# Altium schematic sheet 11_PWR_SYS.SchDoc
size 420 x 297 mm; DocumentNumber: LM2596S-5.0; SheetNumber: 11; SheetTotal: 11
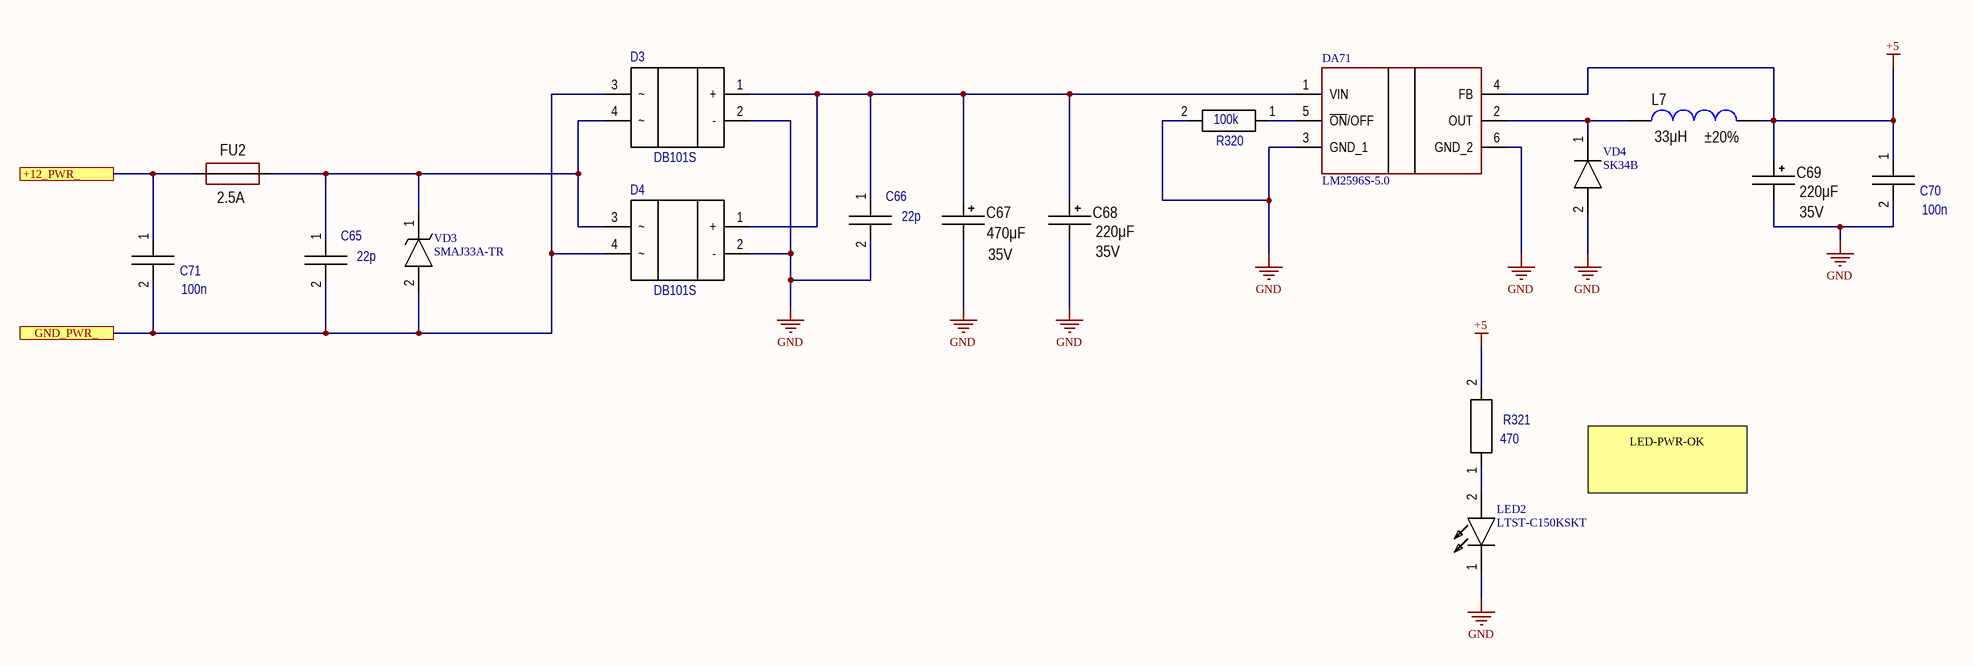
[diagram p0: 11_PWR_SYS.SchDoc]

## Parts
C65  value 22p  [C0603]  (hidden comment: C0603)
C66  value 22p  [C0603]  (hidden comment: C0603)
C67  value 470μF  Voltage: 35V  [CAP: D10C5H16]
C68  value 220μF  Voltage: 35V  [CAP: D8C3.5H12]
C69  value 220μF  Voltage: 35V  [CAP: D8C3.5H12]
C70  value 100n  [C0603]  (hidden comment: C0603)
C71  value 100n  [C0603]  (hidden comment: C0603)
D3  DB101S  [DB-1S]
D4  DB101S  [DB-1S]
DA71  LM2596S-5.0  [KTT0005B]
FU2  MaxCurrent: 2.5A  [FUSE: 1206]
L7  value 33μH  Tolerance: ±20%  [INDPM102100X400N]
LED2  LTST-C150KSKT  [LEDC3216X110N]
R320  value 100k  [RESC1608N]  (hidden comment: R0603)
R321  value 470  [RESC1608N]  (hidden comment: R0603)
VD3  SMAJ33A-TR  [SM4T82AY]
VD4  SK34B  [DIOM5236X261N]

## Ports
+12_PWR_, GND_PWR_

## Nets
+5: C69.1 C70.1 DA71.4(FB) L7.1 R321.2
GND: C66.2 C67.2 C68.2 C69.2 C70.2 D3.2(-) D4.2(-) DA71.3(GND_1) DA71.6(GND_2) LED2.1(K) R320.2 VD4.2(A)
+12_PWR_: C71.1 FU2.1 ; port +12_PWR_
GND_PWR_: C65.2 C71.2 D3.3 D4.4 VD3.2(A) ; port GND_PWR_
NetC65_1: C65.1 D3.4 D4.3 FU2.2 VD3.1(K)
NetC66_1: C66.1 C67.1 C68.1 D3.1(+) D4.1(+) DA71.1(VIN)
NetDA71_2: DA71.2(OUT) L7.2 VD4.1(K)
NetDA71_5: DA71.5(~{ON}/OFF) R320.1
NetLED2_2: LED2.2(A) R321.1

## Notes on the sheet
- LED-PWR-OK
- Подп. и дата
- Инв. № дубл.
- Взам. инв. №
- Инв. № подл.
- Изм.
- Лист
- № докум.
- Подп.
- Дата
- 2.106-A3
- Копировал
- Формат А3

## Library data of the parts
C65 C66 = GRM1885C1H220JA01D: Manufacturer: Murata Manufacturing; Код: 80; ID: Конденсатор; Power/Voltage: 50V; Tolerance: ±5%; TKE: c0g; iii: Конденсатор GRM1885C1H220JA01D 22p 50V ±5% C0603 c0g Murata Manufacturing; Comments: C0603; Part Number: GRM1885C1H220JA01D; Package: C0603; TemperatureMin: -55; TemperatureMax: 125
C67 = Capacitors_Aluminium: ECAP (К50-35), 470мкФ, 35В, 105°C, 20%, 10x17мм P:5мм; Manufacturer: JB Capacitors; PartNumber: JRB1V471M05001000170000B; ValueManufacturerPartNumber: Aluminium capacitor, 470μF, 35V, ±20%, 54mOhm, D10H17P5, -55...+105°C; TypeCapacitor: Aluminium capacitor; Impedance: 54mOhm; Package: D10H17P5; Temperature: -55...+105°C; Tolerance: ±20%
C68 C69 = Capacitors_Aluminium: ECAP (К50-35), 220мкФ, 35В, 105°C, 20%, 8x12мм P:3.5мм, Конденсатор электролитический алюминиевый; Manufacturer: JB Capacitors; PartNumber: JRB1V221M03500800120000B; ValueManufacturerPartNumber: Aluminium capacitor, 220μF, 35V, ±20%, 54mOhm, D8C3.5H12, -55...+105°C; TypeCapacitor: Aluminium capacitor; Impedance: 54mOhm; Package: D8C3.5H12; Temperature: -55...+105°C; Tolerance: ±20%
C70 C71 = GRM188R71C104KA01D: Manufacturer: Murata Manufacturing; Код: 22; ID: Конденсатор; Power/Voltage: 16V; Tolerance: ±10%; TKE: X7R; iii: Конденсатор GRM188R71C104KA01D 100n 16V ±10% C0603 X7R  Murata Manufacturing; Comments: C0603; Part Number: GRM188R71C104KA01D; Height: 0.9; Package: C0603; TemperatureMin: -55; TemperatureMax: 125
D3 D4 = DB101S: SINGLE-PHASE SURFACE MOUNT BRIDGE RECTIFIER; Manufacturer: DC COMPONENTS; Код: 5; ID: Диодный мост; Value: 1A; Power/Voltage: 50V; iii: Диодный мост DB101S 1A 50V    DC COMPONENTS; Com: DB101S; Part Number: DB101S; ComponentLink1Description: Datasheet; ComponentLink1URL: \\server_altium\ServerShare\Schematic\pdf\DB101S.pdf; TemperatureMin: -55; TemperatureMax: 150
DA71 = LM2596S-5.0: Integrated Circuit; Manufacturer_Name: Texas Instruments; Datasheet Link: https://www.ti.com/lit/gpn/LM2596; PartNumber: LM2596S-5.0; Mouser Part Number: 926-LM2596S-50; Mouser Price/Stock: https://www.mouser.co.uk/ProductDetail/Texas-Instruments/LM2596S-5.0?qs=X1J7HmVL2ZGcOr96VNr%252B%2Fw%3D%3D; Arrow Part Number: LM2596S-5.0; Arrow Price/Stock: https://www.arrow.com/en/products/lm2596s-5.0/texas-instruments?region=nac
FU2 = Fuse: Manufacturer: 046602.5NR; VoltageMax: 13; Package: 1206; ValueManufacturerPartNumber: =TypeFuse+', '+VoltageMax+', '+MaxCurrent+', '+Package+', '+Temperature; PartNumber: 046602.5NR
L7 = Inductor_: CDRH104RNP-330NC; Manufacturer: Sumida; ValueManufacturerPartNumber: Fixed inductor, 33μH, ±20%, CDRH104RNP-330NC, 2.2A, -55...+125°C; TypeInductor: Fixed inductor; MaxCurrent: 2.2A; PartNumber: CDRH104RNP-330NC; Package: CDRH104RNP-330NC; Temperature: -55...+125°C
LED2 = LTST-C150KSKT: LED; Manufacturer_Name: Lite-On; Datasheet Link: https://componentsearchengine.com/Datasheets/1/LTST-C150KSKT.pdf; Height: 1.1mm; Manufacturer_Part_Number: LTST-C150KSKT; Mouser Part Number: 859-LTST-C150KSKT; Mouser Price/Stock: https://www.mouser.co.uk/ProductDetail/Lite-On/LTST-C150KSKT?qs=BwFLjhzUaKkzXUKRSgwLjg%3D%3D; Arrow Part Number: LTST-C150KSKT; Arrow Price/Stock: https://www.arrow.com/en/products/ltst-c150kskt/lite-on-technology?region=nac
R320 = RC0603FK-07100KL: Manufacturer: Тайвань; Код: 24; ID: Резистор; Power/Voltage: 0.063W/50V; Tolerance: ±1%; iii: Резистор RC0603FK-07100KL 100k 0.063W/50V ±1% R0603  Тайвань; Comments: R0603; Part Number: RC0603FK-07100KL; Package: R0603; TemperatureMin: -55; TemperatureMax: 155
R321 = RC0603FK-07470RL: Manufacturer: Тайвань; Код: 20; ID: Резистор; Power/Voltage: 0.063W/50V; Tolerance: ±1%; iii: Резистор RC0603FK-07470RL 470 0.063W/50V ±1% R0603  Тайвань; Comments: R0603; Part Number: RC0603FK-07470RL; Package: R0603; TemperatureMin: -55; TemperatureMax: 155
VD3 = SMAJ33A-TR: TVS Diode (Uni-directional); Manufacturer_Name: STMicroelectronics; Datasheet Link: https://www.st.com/resource/en/datasheet/smaj10ca.pdf; Height: 2.65mm; PartNumber: SMAJ33A-TR; Mouser Part Number: 511-SMAJ33A-TR; Mouser Price/Stock: https://www.mouser.co.uk/ProductDetail/STMicroelectronics/SMAJ33A-TR?qs=jwZhmErakJAmVBO%2Fr9%252BXpg%3D%3D; Arrow Part Number: SMAJ33A-TR; Arrow Price/Stock: https://www.arrow.com/en/products/smaj33a-tr/stmicroelectronics?region=europe
VD4 = SK34B: Diode; Manufacturer_Name: Taiwan Semiconductor; PartNumber: SK34; Datasheet Link: https://componentsearchengine.com/Datasheets/2/SK34B.pdf; Height: 2.61mm; Mouser Part Number: 821-SK34B; Mouser Price/Stock: https://www.mouser.co.uk/ProductDetail/Taiwan-Semiconductor/SK34B?qs=tHU%2FlV7kTyScurMVJgLz7Q%3D%3D